# Altium schematic sheet DS3231.SchDoc
size A; SheetNumber: 3; SheetTotal: 9
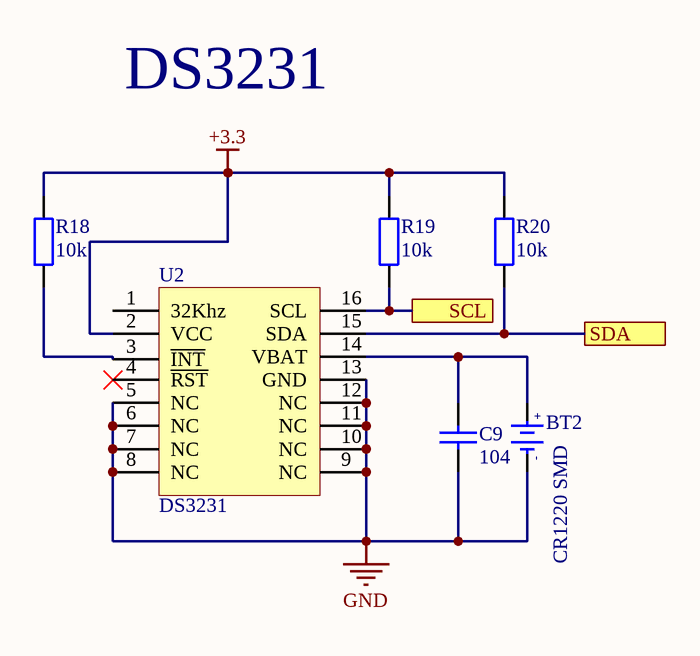
[diagram p0: DS3231.SchDoc]

## Parts
BT2  CR1220 SMD  [DE PIN CR1220]
C9  104  [tu 0603]
R18  10k  [tro smd 0603]
R19  10k  [tro smd 0603]
R20  10k  [tro smd 0603]
U2  DS3231  [SOIC 16]

## Ports
SCL, SDA

## Nets
+3.3: R18.2 R19.2 R20.2 U2.2(VCC)
GND: BT2.2(GND) C9.2 U2.5(NC) U2.6(NC) U2.7(NC) U2.8(NC) U2.9(NC) U2.10(NC) U2.11(NC) U2.12(NC) U2.13(GND)
SCL: R19.1 U2.16(SCL) ; port SCL
SDA: R20.1 U2.15(SDA) ; port SDA
NetBT2_1: BT2.1(+3V) C9.1 U2.14(VBAT)
NetR18_1: R18.1 U2.3(~{INT})

Not connected (* = marked no-connect by the designer): U2 1(32Khz) 4(~{RST})*

## Notes on the sheet
- DS3231
- (in symbol De pin CR1220 SMD) +; -

## Library data of the parts
BT2 = De pin CR1220 SMD: Ten: Đế PIN CR1220 SMD; Ma_Hang: MH000833
C9 = Tu 0603 104 50V 10%: Dán; Don_Vi: Con; So_Chan: 2; Ten_Linh_Kien: Tụ 0603 104-100nF 10% 50V; Ma_Hang: MH004568; Chung_Loai: Dán; Kieu_Chan: *
R18-R20 = Tro 0603 1% 10k: Dán; Don_Vi: Con; So_Chan: 2; Ten_Linh_Kien: Trở 0603 1% 10k; Ma_Hang: MH006333; Chung_Loai: Dán; Kieu_Chan: *
U2 = DS3231 SMD: SOIC